# Altium schematic sheet Power&CAN.SchDoc
size A4
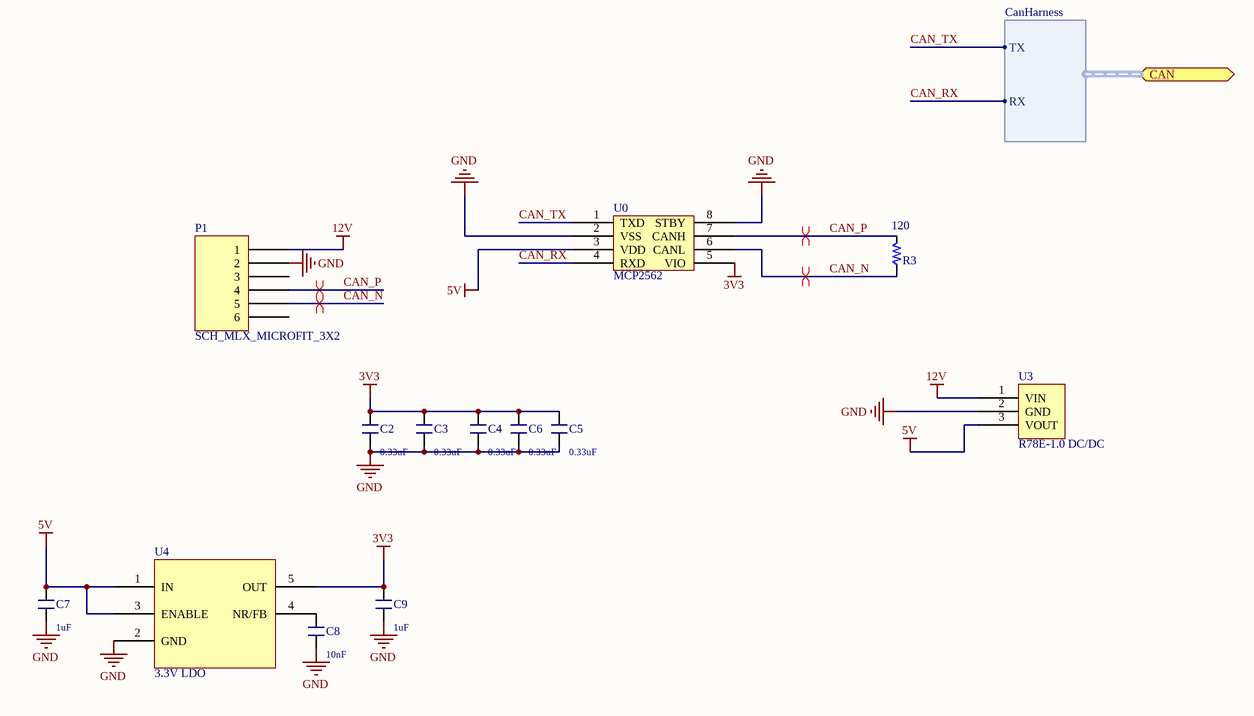
[diagram p0: Power&CAN.SchDoc]

## Parts
C2  Capacitance: 0.33uF  [PCB_GENERIC_SMD_0603]  (hidden comment: SCH_GENERIC_CAPACITOR_0603)
C3  Capacitance: 0.33uF  [PCB_GENERIC_SMD_0603]  (hidden comment: SCH_GENERIC_CAPACITOR_0603)
C4  Capacitance: 0.33uF  [PCB_GENERIC_SMD_0603]  (hidden comment: SCH_GENERIC_CAPACITOR_0603)
C5  Capacitance: 0.33uF  [PCB_GENERIC_SMD_0603]  (hidden comment: SCH_GENERIC_CAPACITOR_0603)
C6  Capacitance: 0.33uF  [PCB_GENERIC_SMD_0603]  (hidden comment: SCH_GENERIC_CAPACITOR_0603)
C7  Capacitance: 1uF  [PCB_GENERIC_SMD_0603]  (hidden comment: SCH_GENERIC_CAPACITOR_0603)
C8  Capacitance: 10nF  [PCB_GENERIC_SMD_0603]  (hidden comment: SCH_GENERIC_CAPACITOR_0603)
C9  Capacitance: 1uF  [PCB_GENERIC_SMD_0603]  (hidden comment: SCH_GENERIC_CAPACITOR_0603)
P1  SCH_MLX_MICROFIT_3X2  [PCB_MLX_MICROFIT_3X2]
R3  Resistance: 120  [PCB_GENERIC_SMD_0603]  (hidden comment: SCH_GENERIC_RESISTOR_0603)
U0  MCP2562  [SOIC127P600X175-8N]
U3  R78E-1.0 DC/DC  [R78-1.0]
U4  3.3V LDO  [SOT95P280X145-5N]

## Ports
CAN (harness CanHarness)

## Harnesses
CanHarness: TX, RX

## Nets
3V3: C2.2 C3.2 C4.2 C5.2 C6.2 C9.2 U0.5(VIO) U4.5(OUT)
5V: C7.2 U0.3(VDD) U3.3(VOUT) U4.1(IN) U4.3(ENABLE)
12V: P1.1 U3.1(VIN)
GND: C2.1 C3.1 C4.1 C5.1 C6.1 C7.1 C8.1 C9.1 P1.2 U0.2(VSS) U0.8(STBY) U3.2(GND) U4.2(GND)
CAN_N: P1.5 R3.1 U0.6(CANL)
CAN_P: P1.4 R3.2 U0.7(CANH)
CAN_RX: U0.4(RXD) ; port CAN.RX
CAN_TX: U0.1(TXD) ; port CAN.TX
NetC8_2: C8.2 U4.4(NR/FB)

Not connected (* = marked no-connect by the designer): P1 3 6

## Layout directives
differential pair: CAN_N, CAN_P

## Library data of the parts
C2-C9 = SCH_GENERIC_CAPACITOR_0603: Generic SMD capacitor 0603; Tolerance: *%
R3 = SCH_GENERIC_RESISTOR_0603: Generic SMD resistor 0603
U0 = MCP2562: 1/1 Transceiver Full CAN 8-SOIC
U3 = R78E-1.0
U4 = 3V3LDO_TPS73633DBVR_SOT23-5: Linear Voltage Regulator IC Positive Fixed 1 Output 3.3V 400mA SOT-23-5